# EAGLE design untitled (EAGLE 7.2.0)
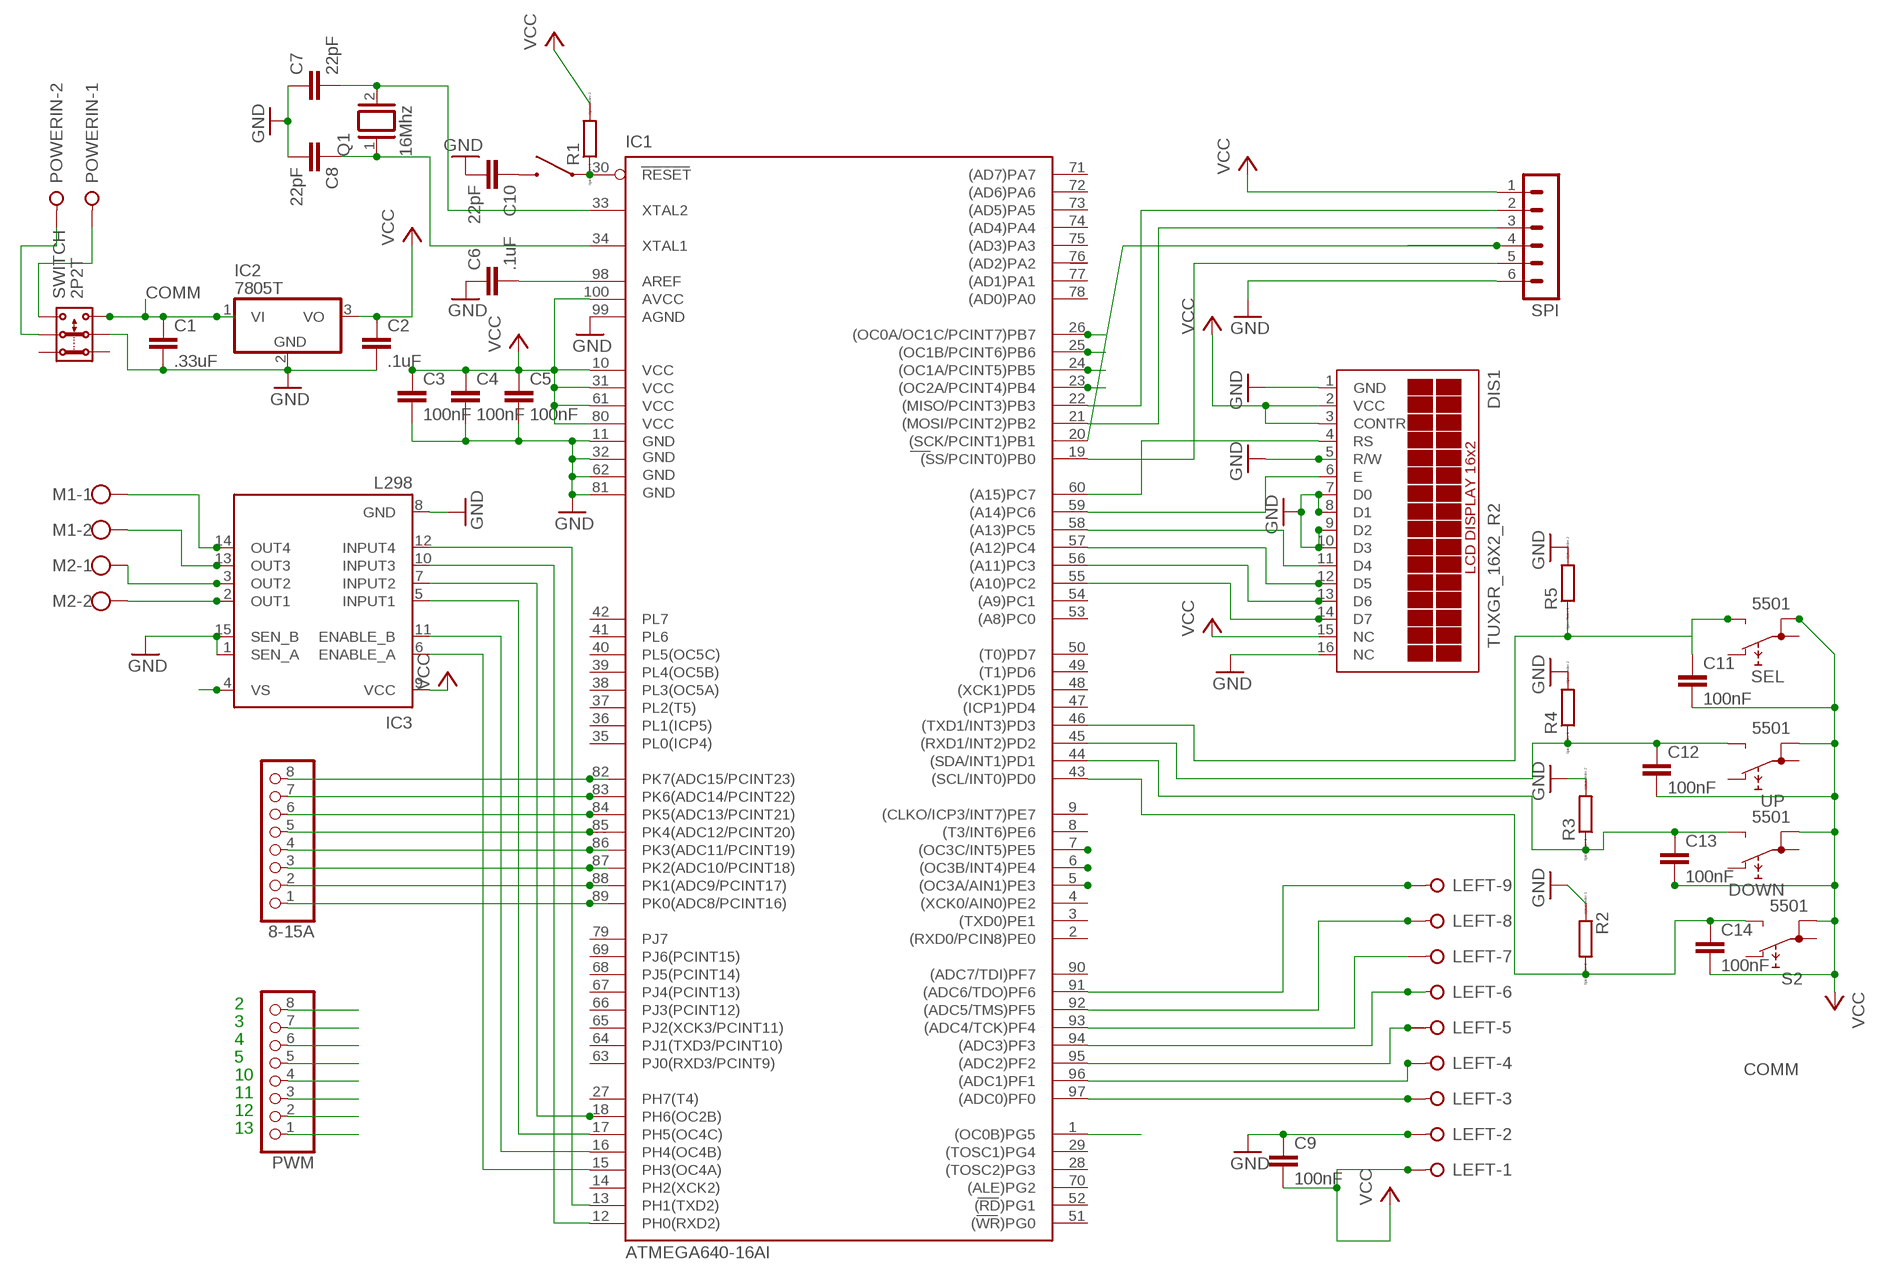
[diagram p0: schematic, sheet 1]

## Parts
8-15A  PINHD-1X8  [1X08]
C1  .33uF  C-EUC0805  [C0805]
C2  .1uF  C-EUC0805  [C0805]
C3  100nF  C-EUC0805  [C0805]
C4  100nF  C-EUC0805  [C0805]
C5  100nF  C-EUC0805  [C0805]
C6  .1uF  C-EUC0805  [C0805]
C7  22pF  C-EUC0805  [C0805]
C8  22pF  C-EUC0805  [C0805]
C9  100nF  C-EUC0805  [C0805]
C10  22pF  C-EUC0805  [C0805]
C11  100nF  C-EUC0805  [C0805]
C12  100nF  C-EUC0805  [C0805]
C13  100nF  C-EUC0805  [C0805]
C14  100nF  C-EUC0805  [C0805]
DIS1  TUXGR_16X2_R2  [TUXGR_16X2_R2]
DOWN  5501  [5501]
IC1  ATMEGA640-16AI  [TQFP100]
IC2  7805T  [TO220H]
IC3  L298  [MULTIWATT-15]
LEFT  W237-09P  [W237-9P]
M1  W237-102  [W237-102]
M2  W237-102  [W237-102]
POWERIN  W237-02P  [W237-132]
PWM  PINHD-1X8  [1X08]
Q1  16Mhz  XTAL/S  [QS]
R1  R  [R0805]
R2  R  [R0805]
R3  R  [R0805]
R4  R  [R0805]
R5  R  [R0805]
S2  5501  [5501]
SEL  5501  [5501]
SPI  MA06-1  [MA06-1]
SWITCH  2P2T  [2P2T]
U$1  TACT-SWITCH-40-40  [40-40]
UP  5501  [5501]

## Nets
2: IC1.6((OC3B/INT4)PE4) PWM.8
3: IC1.7((OC3C/INT5)PE5) PWM.7
4: IC1.1((OC0B)PG5) PWM.6
5: IC1.5((OC3A/AIN1)PE3) PWM.5
10: IC1.23((OC2A/PCINT4)PB4) PWM.4
11: IC1.24((OC1A/PCINT5)PB5) PWM.3
12: IC1.25((OC1B/PCINT6)PB6) PWM.2
13: IC1.26((OC0A/OC1C/PCINT7)PB7) PWM.1
24: IC1.76((AD2)PA2)
COMM: C1.1 IC2.1(VI) IC3.4(VS) SWITCH.3.2
GND: C1.2 C2.2 C3.2 C4.2 C5.2 C6.1 C7.1 C8.2 C9.1 C10.2 DIS1.1(GND) DIS1.5(R/W) DIS1.7(D0) DIS1.8(D1) DIS1.9(D2) DIS1.10(D3) DIS1.16(NC) IC1.11(GND) IC1.32(GND1) IC1.62(GND2) IC1.81(GND3) IC1.99(AGND) IC2.2(GND) IC3.1(SEN_A) IC3.8(GND) IC3.15(SEN_B) LEFT.2 R2.1 R3.2 R4.2 R5.2 SPI.6 SWITCH.2.2
N$1: POWERIN.1 SWITCH.3.1
N$2: IC3.13(OUT3) M1.2
N$3: IC3.14(OUT4) M1.1
N$4: IC3.2(OUT1) M2.2
N$5: IC3.3(OUT2) M2.1
N$6: POWERIN.2 SWITCH.2.1
N$7: C6.2 IC1.98(AREF)
N$8: C7.2 IC1.33(XTAL2) Q1.2
N$9: C8.1 IC1.34(XTAL1) Q1.1
N$10: IC1.97((ADC0)PF0) LEFT.3
N$11: C10.1 U$1.1 U$1.2
N$12: IC1.96((ADC1)PF1) LEFT.4
N$13: IC1.95((ADC2)PF2) LEFT.5
N$14: IC1.94((ADC3)PF3) LEFT.6
N$15: IC1.93((ADC4/TCK)PF4) LEFT.7
N$16: IC1.92((ADC5/TMS)PF5) LEFT.8
N$17: IC1.91((ADC6/TDO)PF6) LEFT.9
N$18: DIS1.4(RS) IC1.60((A15)PC7)
N$19: DIS1.6(E) IC1.59((A14)PC6)
N$20: DIS1.11(D4) IC1.58((A13)PC5)
N$21: DIS1.12(D5) IC1.57((A12)PC4)
N$22: DIS1.13(D6) IC1.56((A11)PC3)
N$23: DIS1.14(D7) IC1.55((A10)PC2)
N$24: IC1.15(PH3(OC4A)) IC3.6(ENABLE_A)
N$25: IC1.16(PH4(OC4B)) IC3.11(ENABLE_B)
N$26: IC1.17(PH5(OC4C)) IC3.5(INPUT1)
N$27: IC1.18(PH6(OC2B)) IC3.7(INPUT2)
N$28: IC1.12(PH0(RXD2)) IC3.10(INPUT3)
N$29: IC1.13(PH1(TXD2)) IC3.12(INPUT4)
N$30: IC1.30(RESET) R1.1 U$1.3 U$1.4
N$31: IC1.22((MISO/PCINT3)PB3) SPI.2
N$32: IC1.21((MOSI/PCINT2)PB2) SPI.3
N$33: IC1.20((SCK/PCINT1)PB1) SPI.4
N$34: IC1.19((SS/PCINT0)PB0) SPI.5
N$35: C14.1 IC1.43((SCL/INT0)PD0) R2.2 S2.NO
N$36: C13.1 DOWN.NO IC1.44((SDA/INT1)PD1) R3.1
N$37: C12.1 IC1.45((RXD1/INT2)PD2) R4.1 UP.NO
N$38: C11.1 IC1.46((TXD1/INT3)PD3) R5.1 SEL.NO
N$39: 8-15A.8 IC1.82(PK7(ADC15/PCINT23))
N$40: 8-15A.7 IC1.83(PK6(ADC14/PCINT22))
N$41: 8-15A.6 IC1.84(PK5(ADC13/PCINT21))
N$42: 8-15A.5 IC1.85(PK4(ADC12/PCINT20))
N$43: 8-15A.4 IC1.86(PK3(ADC11/PCINT19))
N$44: 8-15A.3 IC1.87(PK2(ADC10/PCINT18))
N$45: 8-15A.2 IC1.88(PK1(ADC9/PCINT17))
N$46: 8-15A.1 IC1.89(PK0(ADC8/PCINT16))
VCC: C2.1 C3.1 C4.1 C5.1 C9.2 C11.2 C12.2 C13.2 C14.2 DIS1.2(VCC) DIS1.3(CONTR) DIS1.15(NC) DOWN.1B IC1.10(VCC) IC1.31(VCC1) IC1.61(VCC2) IC1.80(VCC3) IC1.100(AVCC) IC2.3(VO) IC3.9(VCC) LEFT.1 R1.2 S2.1B SEL.1B SPI.1 UP.1B
Unconnected: DOWN.1A DOWN.NC IC1.2((RXD0/PCIN8)PE0) IC1.3((TXD0)PE1) IC1.4((XCK0/AIN0)PE2) IC1.8((T3/INT6)PE6) IC1.9((CLKO/ICP3/INT7)PE7) IC1.14(PH2(XCK2)) IC1.27(PH7(T4)) IC1.28((TOSC2)PG3) IC1.29((TOSC1)PG4) IC1.35(PL0(ICP4)) IC1.36(PL1(ICP5)) IC1.37(PL2(T5)) IC1.38(PL3(OC5A)) IC1.39(PL4(OC5B)) IC1.40(PL5(OC5C)) IC1.41(PL6) IC1.42(PL7) IC1.47((ICP1)PD4) IC1.48((XCK1)PD5) IC1.49((T1)PD6) IC1.50((T0)PD7) IC1.51((WR)PG0) IC1.52((RD)PG1) IC1.53((A8)PC0) IC1.54((A9)PC1) IC1.63(PJ0(RXD3/PCINT9)) IC1.64(PJ1(TXD3/PCINT10)) IC1.65(PJ2(XCK3/PCINT11)) IC1.66(PJ3(PCINT12)) IC1.67(PJ4(PCINT13)) IC1.68(PJ5(PCINT14)) IC1.69(PJ6(PCINT15)) IC1.70((ALE)PG2) IC1.71((AD7)PA7) IC1.72((AD6)PA6) IC1.73((AD5)PA5) IC1.74((AD4)PA4) IC1.75((AD3)PA3) IC1.77((AD1)PA1) IC1.78((AD0)PA0) IC1.79(PJ7) IC1.90((ADC7/TDI)PF7) S2.1A S2.NC SEL.1A SEL.NC SWITCH.1.1 SWITCH.1.2 UP.1A UP.NC

## Notes on the sheet
- 2
- 3
- 4
- 5
- 10
- 11
- 12
- 13

## Library data of the parts
8-15A PWM = pinhead:PINHD-1X8: PIN HEADER
C1-C14 = rcl:C-EU: CAPACITOR, European symbol
DIS1 = display-lcd:TUXGR_16X2_R2: Tuxgraphics LCD display 16x2 characters reflective, without background light Source: tuxgr_12x2_r2.pdf; OC_FARNELL: unknown; OC_NEWARK: unknown
DOWN S2 SEL UP = switch:55?: PUSHBUTTON SERIES 5500 SWITCHES Source: www.e-switch.com .. 5500.pdf
IC1 = atmel-2005:ATMEGA*: MICROCONTROLLER 64/128/256 Kbytes FLASH 4 Kbytes EEPROM 8 Kbytes SRAM 86 General Purpose I/O pins 12-channels16-bit PWM 4 x Serial USARTs 16-channels 10-bit A/D
IC2 = linear:78*: Positive VOLTAGE REGULATOR Source: http://cache.national.com/ds/LM/LM78L05.pdf http://www.fairchildsemi.com/ds/LM/LM7805.pdf
IC3 = st-microelectronics:L298: DUAL FULL-BRIDGE DRIVER; MPN: L298N; OC_FARNELL: 1589425; OC_NEWARK: 32M1527
LEFT = con-wago-508:W237-09P: WAGO SREW CLAMP; OC_FARNELL: unknown; OC_NEWARK: unknown
M1 M2 = con-wago-500:W237-102: WAGO SCREW CLAMP; MPN: 237-102; OC_FARNELL: unknown; OC_NEWARK: 70K9898
POWERIN = con-wago-508:W237-02P: WAGO SREW CLAMP; OC_FARNELL: unknown; OC_NEWARK: unknown
Q1 = special:XTAL/S: CRYSTAL
R1-R5 = eagle-ltspice:R: RESISTOR, European symbol; SPICEMODEL: NONE; SPICEPREFIX: R
SPI = con-lstb:MA06-1: PIN HEADER; OC_FARNELL: unknown; OC_NEWARK: unknown
SWITCH = switch:2P2T: SLIDE SWITCH 2P2T Part No. SS-22F05-G(A)4 Source: CANAL ELECTRONIC CO., LTD .. switsch.pdf
U$1 = tactile-switch:TACT-SWITCH-40-40

## Board
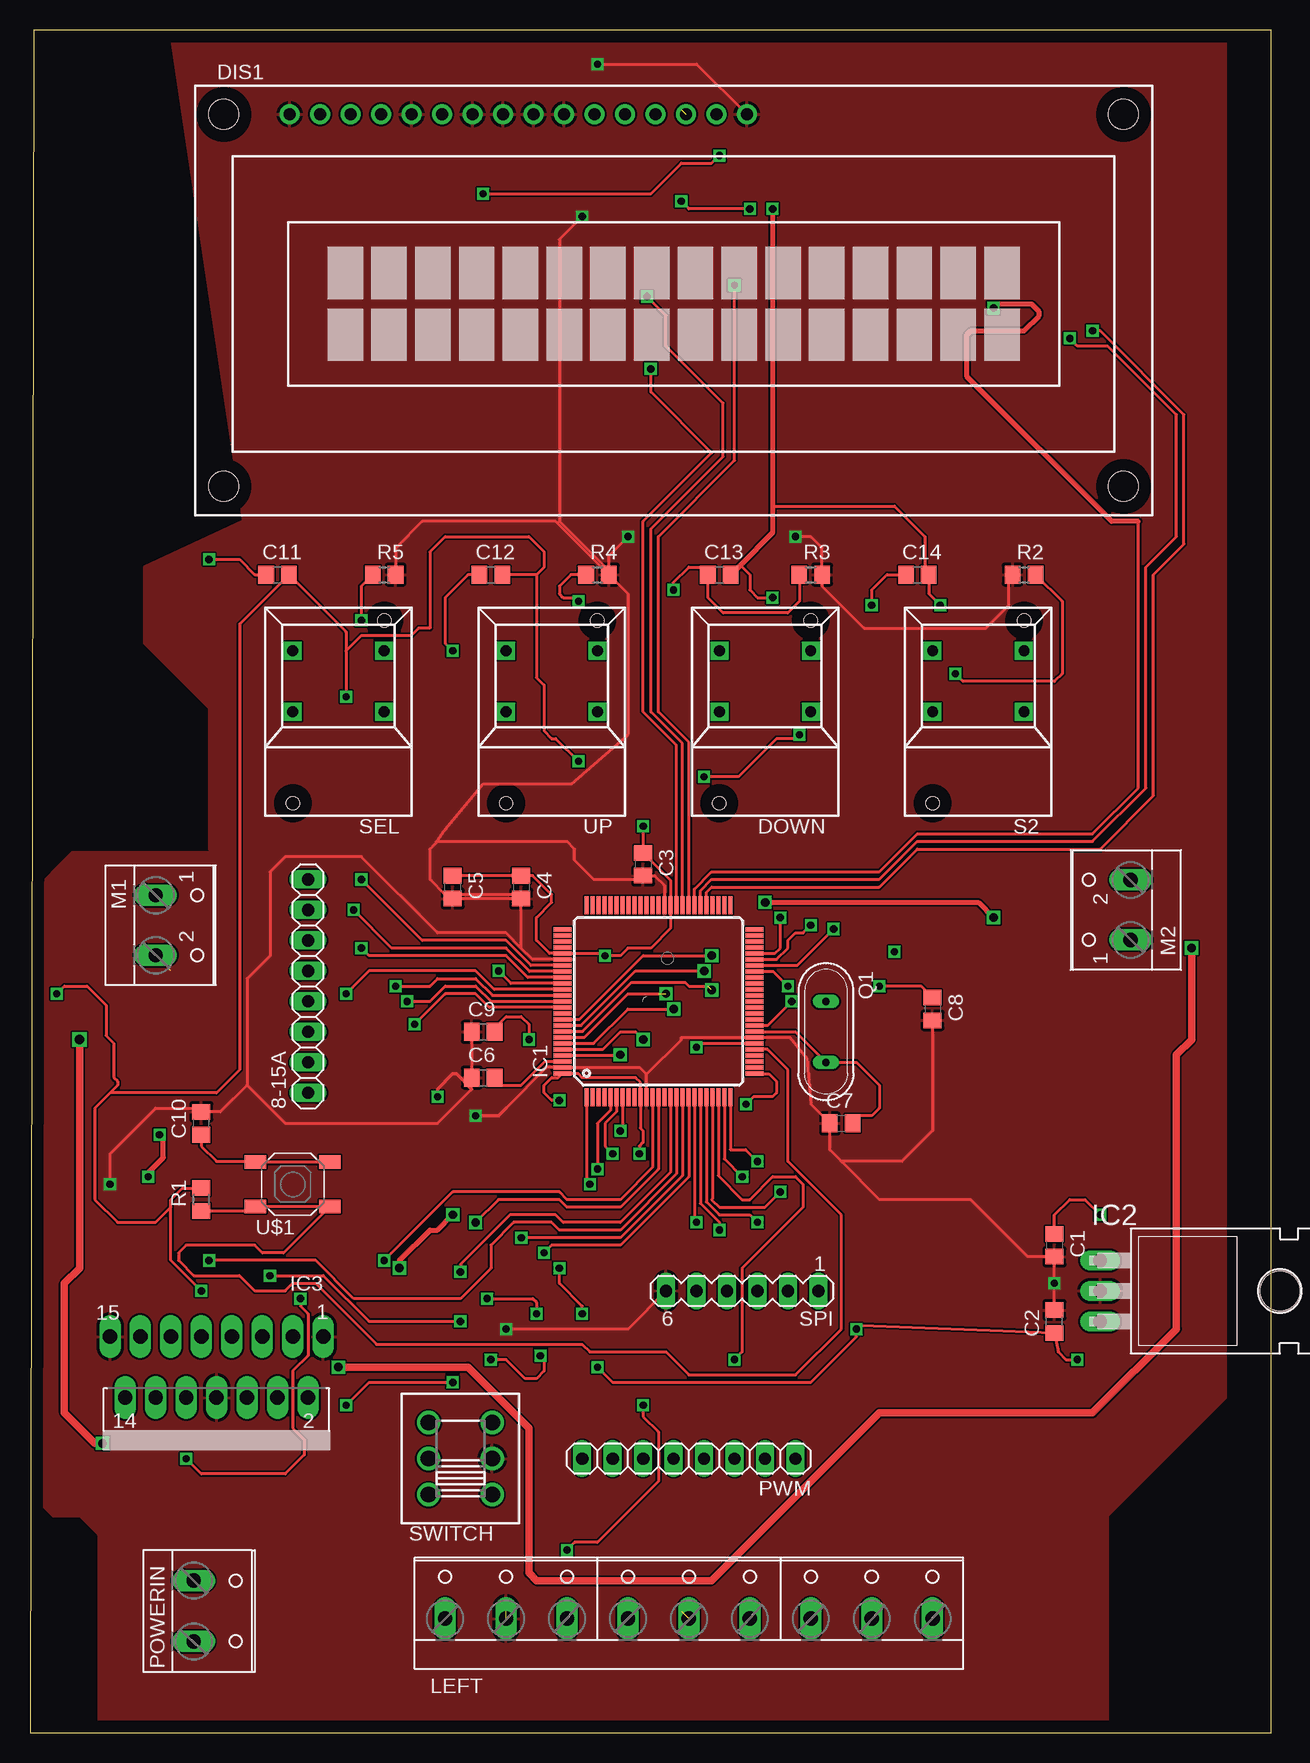
[diagram p1: board, top side]
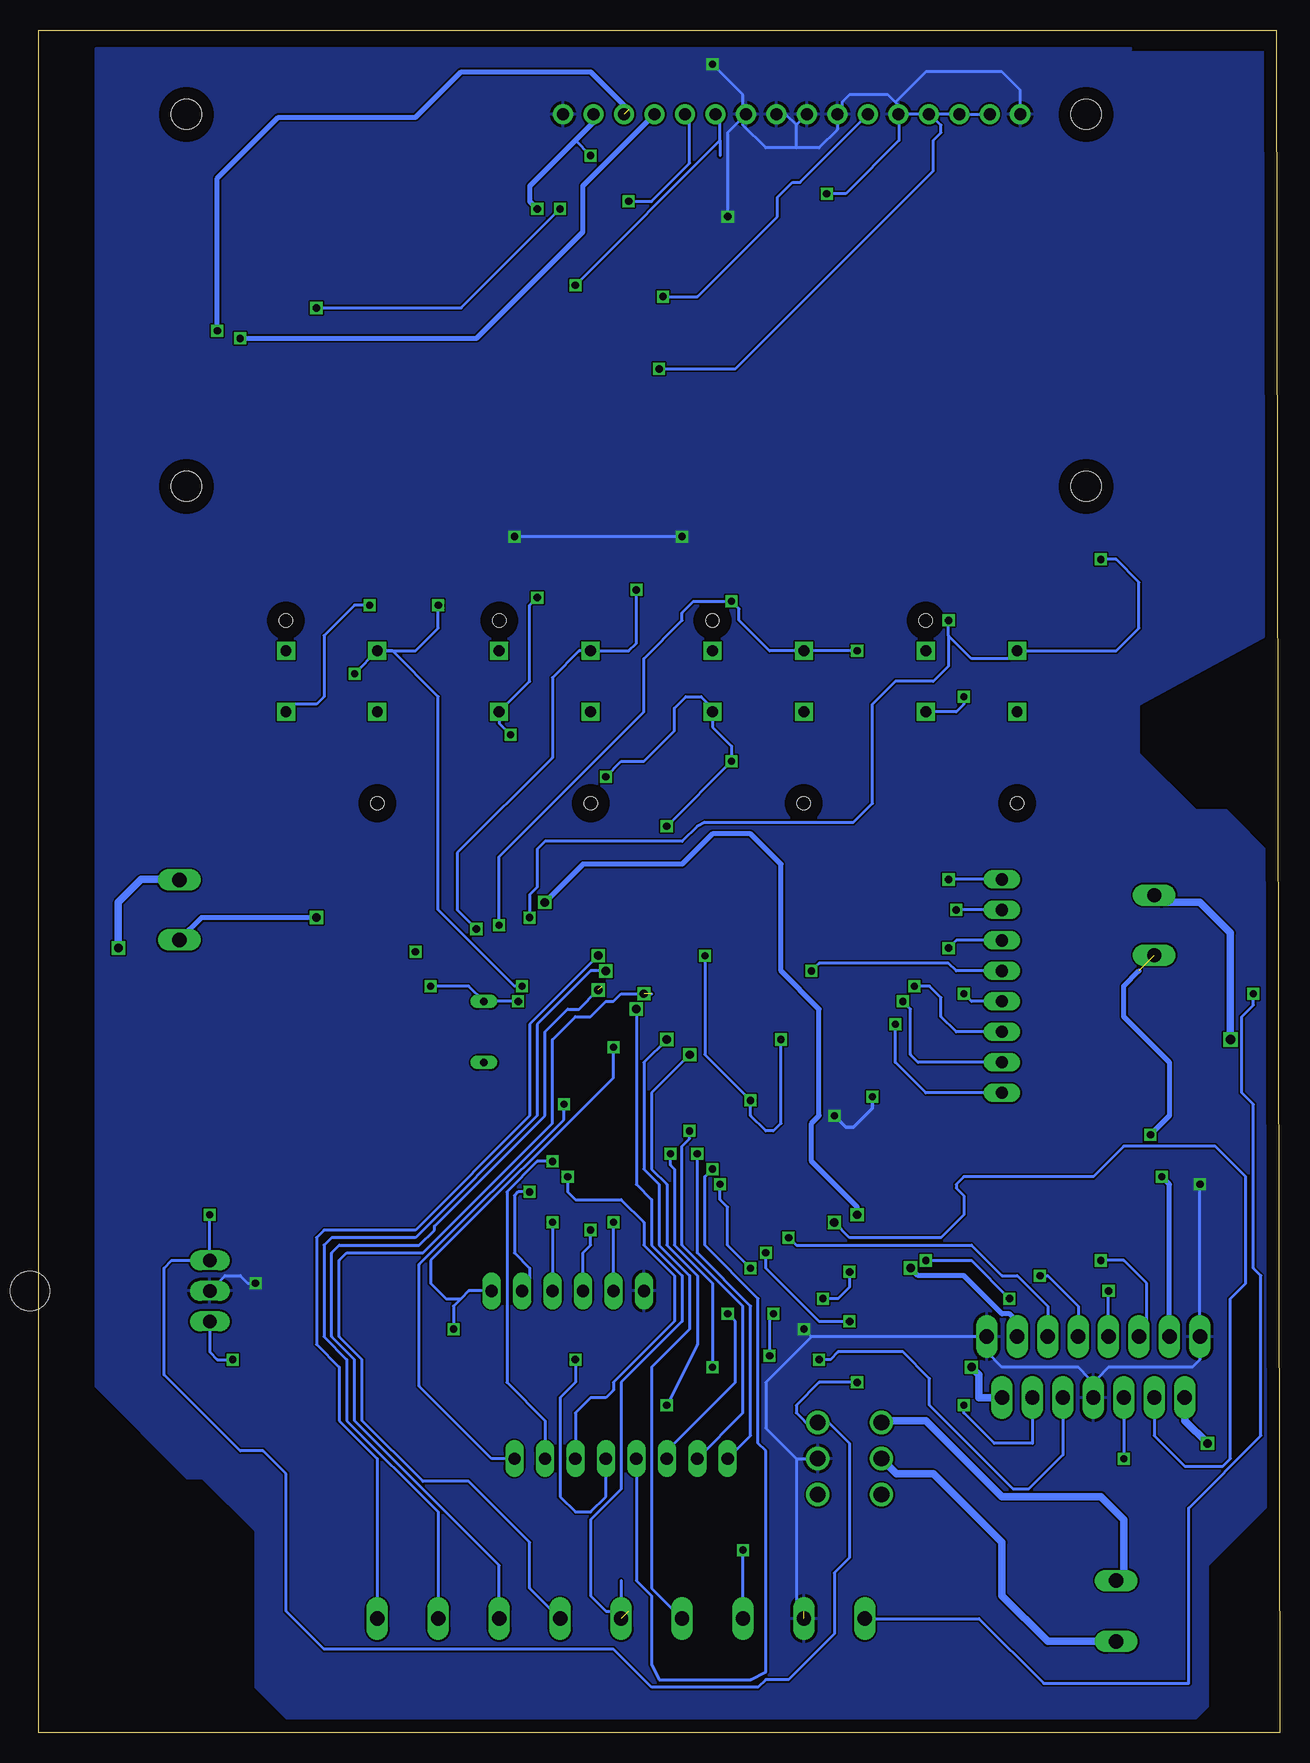
[diagram p2: board, bottom side, seen from below]

Size 103.48 x 141.91 mm. Coordinates in mm from the lower left corner, seen from the top.
Outline: 0,0 103.49,0 103.49,141.91 0.32,141.91 0,0
Copper layers (1*16): Top 0.035mm / dielectric 1.5mm / Bottom 0.035mm
Design rules "default *": minimum track width 10mil, minimum drill 24mil, track to track 6mil, track to pad 6mil, pad to pad 4mil, via to via 6mil, smd to smd 2mil, copper to edge 40mil, drill to drill 6mil, minimum pad ring 10mil, minimum via ring 8mil, stop-mask expansion 4mil, vias tented up to drill 0mil, thermal gap 10mil

### Footprints (pad centres in the part's own frame; a part is rotated, then mirrored left to right if it is on the bottom)
1X08 = drill 1.016 long: 1 -8.89,0; 2 -6.35,0; 3 -3.81,0; 4 -1.27,0; 5 1.27,0; 6 3.81,0; 7 6.35,0; 8 8.89,0
C0805 = smd 1.3 x 1.5: 1 -0.95,0; 2 0.95,0
TUXGR_16X2_R2 = drill 1 pad 1.676: 1 -32,15.5; 2 -29.46,15.5; 3 -26.92,15.5; 4 -24.38,15.5; 5 -21.84,15.5; 6 -19.3,15.5; 7 -16.76,15.5; 8 -14.22,15.5; 9 -11.68,15.5; 10 -9.14,15.5; 11 -6.6,15.5; 12 -4.06,15.5; 13 -1.52,15.5; 14 1.02,15.5; 15 3.56,15.5; 16 6.1,15.5 | hole 2.5: -37.5,-15.5; 37.5,-15.5; -37.5,15.5; 37.5,15.5
5501 = drill 0.9 pad 1.5 square: 1A 0,3.81; 1B 0,-3.81; NC 5.08,-3.81; NO 5.08,3.81 | hole 1.1: -7.62,3.81; 7.62,-3.81
TQFP100 = smd 1.5 x 0.35: 1 -8,6; 2 -8,5.5; 3 -8,5; 4 -8,4.5; 5 -8,4; 6 -8,3.5; 7 -8,3; 8 -8,2.5; 9 -8,2; 10 -8,1.5; 11 -8,1; 12 -8,0.5; 13 -8,0; 14 -8,-0.5; 15 -8,-1; 16 -8,-1.5; 17 -8,-2; 18 -8,-2.5; 19 -8,-3; 20 -8,-3.5; 21 -8,-4; 22 -8,-4.5; 23 -8,-5; 24 -8,-5.5; 25 -8,-6; 51 8,-6; 52 8,-5.5; 53 8,-5; 54 8,-4.5; 55 8,-4; 56 8,-3.5; 57 8,-3; 58 8,-2.5; 59 8,-2; 60 8,-1.5; 61 8,-1; 62 8,-0.5; 63 8,0; 64 8,0.5; 65 8,1; 66 8,1.5; 67 8,2; 68 8,2.5; 69 8,3; 70 8,3.5; 71 8,4; 72 8,4.5; 73 8,5; 74 8,5.5; 75 8,6 | smd 0.35 x 1.5: 26 -6,-8; 27 -5.5,-8; 28 -5,-8; 29 -4.5,-8; 30 -4,-8; 31 -3.5,-8; 32 -3,-8; 33 -2.5,-8; 34 -2,-8; 35 -1.5,-8; 36 -1,-8; 37 -0.5,-8; 38 0,-8; 39 0.5,-8; 40 1,-8; 41 1.5,-8; 42 2,-8; 43 2.5,-8; 44 3,-8; 45 3.5,-8; 46 4,-8; 47 4.5,-8; 48 5,-8; 49 5.5,-8; 50 6,-8; 76 6,8; 77 5.5,8; 78 5,8; 79 4.5,8; 80 4,8; 81 3.5,8; 82 3,8; 83 2.5,8; 84 2,8; 85 1.5,8; 86 1,8; 87 0.5,8; 88 0,8; 89 -0.5,8; 90 -1,8; 91 -1.5,8; 92 -2,8; 93 -2.5,8; 94 -3,8; 95 -3.5,8; 96 -4,8; 97 -4.5,8; 98 -5,8; 99 -5.5,8; 100 -6,8
TO220H = drill 1.118 long: 1 -2.54,-10.16; 2 0,-10.16; 3 2.54,-10.16 | hole 3.302: 0,4.826
MULTIWATT-15 = drill 1.2 long: 1 -8.89,-7.62; 2 -7.62,-2.54; 3 -6.35,-7.62; 4 -5.08,-2.54; 5 -3.81,-7.62; 6 -2.54,-2.54; 7 -1.27,-7.62; 8 0,-2.54; 9 1.27,-7.62; 10 2.54,-2.54; 11 3.81,-7.62; 12 5.08,-2.54; 13 6.35,-7.62; 14 7.62,-2.54; 15 8.89,-7.62
W237-9P = drill 1.194 long: 1 -20.32,-0.635; 2 -15.24,-0.635; 3 -10.16,-0.635; 4 -5.08,-0.635; 5 0,-0.635; 6 5.08,-0.635; 7 10.16,-0.635; 8 15.24,-0.635; 9 20.32,-0.635
W237-102 = drill 1.194 long: 1 -2.5,-1.27; 2 2.5,-1.27
W237-132 = drill 1.194 long: 1 -2.54,-0.635; 2 2.54,-0.635
QS = drill 0.61 long: 1 -2.54,0; 2 2.54,0
R0805 = smd 1.3 x 1.5: 1 -0.95,0; 2 0.95,0
MA06-1 = drill 1.016 long: 1 -6.35,0; 2 -3.81,0; 3 -1.27,0; 4 1.27,0; 5 3.81,0; 6 6.35,0
2P2T = drill 1.3 pad 1.93: 1.1 -3,2.65; 1.2 -3,-2.65; 2.1 0,2.65; 2.2 0,-2.65; 3.1 3,2.65; 3.2 3,-2.65
40-40 = smd 1.8 x 1.1: 1 -3.1,1.85; 2 3.1,1.85; 3 -3.1,-1.85; 4 3.1,-1.85

### Placement (x,y rotation side)
8-15A  23.18,62.23 90 top
C1  85.41,40.64 270 top
C2  85.41,34.29 90 top
C3  51.12,72.39 270 top
C4  40.96,70.48 270 top
C5  35.24,70.48 270 top
C6  37.78,54.61 0 top
C7  67.63,50.8 0 top
C8  75.25,60.32 270 top
C9  37.78,58.42 0 top
C10  14.29,50.8 90 top
C11  20.64,96.52 0 top
C12  38.42,96.52 0 top
C13  57.47,96.52 0 top
C14  73.98,96.52 0 top
DIS1  53.66,119.38 0 top
DOWN  61.28,85.09 90 top
IC1  52.39,60.96 90 top
IC2  99.38,36.83 270 top
IC3  15.56,25.4 180 top
LEFT  54.93,10.16 0 top
M1  11.75,67.31 270 top
M2  90.49,68.58 90 top
POWERIN  14.29,10.16 270 top
PWM  54.93,22.86 180 top
Q1  66.36,58.42 270 top
R1  14.29,44.45 90 top
R2  82.87,96.52 0 top
R3  65.09,96.52 0 top
R4  47.31,96.52 0 top
R5  29.53,96.52 0 top
S2  79.06,85.09 90 top
SEL  25.72,85.09 90 top
SPI  59.37,36.83 180 top
SWITCH  35.88,22.86 90 top
U$1  21.91,45.72 0 top
UP  43.5,85.09 90 top

### Tracks (layer width: path | path; a pad name or v marks a point on that pad's centre or on a via)
2  (via drill 0.6)
  Top 0.254: IC1.6 48.89,51.74 47.94,50.8 47.94,48.89 v48.58,48.26
  Bottom 0.254: PWM.8 44.13,24.77 44.13,35.56 48.58,40.01 v48.58,48.26
3  (via drill 0.6)
  Top 0.254: IC1.7 49.39,50.34 v49.21,50.16
  Bottom 0.254: PWM.7 44.77,26.67 44.77,35.56 49.85,40.64 49.85,48.89 49.21,49.53 v49.21,50.16
4  (via drill 0.6)
  Top 0.254: IC1.1 46.39,46.01 v46.67,45.72 | v46.04,34.92 46.04,35.56 44.13,37.46 v44.13,38.73
  Bottom 0.254: v44.13,38.73 46.04,40.64 46.04,43.81 46.67,44.45 v46.67,45.72 | PWM.6 51.12,23.49 45.4,29.21 45.4,34.29 v46.04,34.92
5  (via drill 0.6)
  Top 0.254: IC1.5 48.39,51.88 47.31,50.8 v47.31,46.99
  Bottom 0.254: PWM.5 53.66,12.7 52.39,11.43 52.39,5.71 51.75,4.45 44.13,4.45 42.86,5.08 42.86,23.49 43.5,24.13 43.5,36.2 47.94,40.64 47.94,46.35 v47.31,46.99
10  (via drill 0.6)
  Top 0.254: IC1.23 57.39,46.44 59.37,44.45 60.01,44.45 61.91,46.35 63.82,46.35 64.45,45.72 64.45,43.81 59.37,38.73 59.37,31.75 v58.74,31.11
  Bottom 0.254: v58.74,31.11 58.74,29.21 60.01,27.94 60.01,19.68 58.74,18.41 57.47,18.41 56.2,19.68 PWM.4
11  (via drill 0.6)
  Top 0.254: IC1.24 57.89,47.84 v59.37,46.35
  Bottom 0.254: v59.37,46.35 59.37,45.09 58.74,44.45 54.93,44.45 53.02,42.55 53.02,40.64 50.48,38.1 50.48,34.29 55.56,29.21 55.56,28.57 56.2,27.94 57.47,27.94 58.74,26.67 PWM.3
12  (via drill 0.6)
  Top 0.254: IC1.25 58.39,48.61 59.66,48.61 v60.64,47.62
  Bottom 0.254: v60.64,47.62 61.91,47.62 64.45,45.09 64.45,29.21 61.28,26.04 PWM.2
13  (via drill 0.6)
  Top 0.254: IC1.26 60.42,54.93 61.6,54.93 62.23,54.29 62.23,53.34 61.91,53.02 60.32,53.02 v59.69,52.39
  Bottom 0.254: PWM.1 65.72,22.86 71.75,28.89 71.75,39.05 59.69,51.12 v59.69,52.39
COMM  (via drill 0.6)
  Top 0.254: v26.35,27.3 28.26,29.21 v35.24,29.21 | C1.1 85.41,43.18 86.68,44.45 87.95,44.45 v89.22,43.18
  Bottom 0.254: IC3.4 20.64,24.13 23.81,24.13 26.35,26.67 v26.35,27.3 | v35.24,29.21 38.42,29.21 40.32,27.3 40.32,26.67 39.05,25.4 38.59,25.86 | v89.22,43.18 IC2.1 92.39,39.37 93.03,38.73 93.03,29.84 86.68,23.49 84.77,23.49 82.87,21.59 82.87,10.16 79.69,6.99 55.56,6.99 52.39,3.81 43.5,3.81 42.86,4.45 40.96,4.45 37.15,8.25 37.15,13.34 35.88,14.61 35.88,24.13 37.78,26.04 38.42,26.04 38.59,25.86 | SWITCH.3.2 38.59,25.86
GND  (via drill 0.6)  (2 unrouted)
  Top 0.254: v6.67,45.72 6.67,48.26 10.48,52.07 13.97,52.07 C10.2 15.87,51.75 18.1,53.98 | IC1.11 51.39,54.88 | 51.39,54.88 54.29,57.78 54.29,57.96 IC1.32 63.36,57.96 64.77,56.23 65.09,52.39 C7.1 66.67,48.58 67.63,47.62 | C4.2 C5.2 | C9.1 C6.1 36.83,53.66 33.97,50.8 21.27,50.8 18.1,53.98 | 51.39,54.88 50.81,55.46 IC1.99 43.08,55.46 39.69,52.07 | 40.96,65.41 C4.2 | 40.96,65.41 39.69,66.68 33.97,66.68 27.62,73.03 21.27,73.03 20,71.76 20,64.77 18.1,62.87 18.1,53.98 | IC1.62 52.89,70.62 52.07,71.44 C3.2 50.8,71.12 46.99,71.12 45.4,72.71 45.4,73.66 44.77,74.3 33.97,74.3 33.81,74.14 | IC1.81 41.9,64.46 40.96,65.41 | C4.2 40.96,69.85 34.61,69.85 33.34,71.12 33.34,73.66 33.81,74.14 | v47.31,139.06 55.57,139.06 DIS1.16 | v46.04,126.37 44.13,124.46 44.13,100.97 48.26,96.84 | 48.26,96.84 R4.2 | R4.2 43.81,100.97 32.7,100.97 30.48,98.74 R5.2 | 48.26,96.84 48.26,98.11 v49.85,99.7 | v63.82,99.7 65.09,99.7 66.04,98.75 R3.2 66.04,95.57 69.53,92.08 79.69,92.08 81.6,93.98 81.6,96.2 R2.1 | R4.2 49.85,94.93 49.85,83.19 45.09,79.06 37.78,79.06 34.61,75.25 33.81,74.14 | C2.2 v85.41,37.46 C1.2 83.18,39.69 78.42,44.45 70.8,44.45 67.63,47.62 | SPI.6 49.85,33.66 v39.69,33.66 | C8.2 75.25,50.16 72.71,47.62 67.63,47.62
  Top 0.305: 39.69,52.07 39.05,51.44 v37.15,51.44 | 36.83,53.66 35.57,54.93 35.24,54.93 33.97,53.66 33.97,53.02
  Bottom 0.254: v6.67,45.72 IC3.15 6.67,31.11 7.3,30.48 14.29,30.48 15.24,29.53 15.88,29.53 | 39.05,33.02 IC3.1 24.45,31.75 23.18,30.48 16.83,30.48 15.88,29.53 | 39.05,33.02 42.86,29.21 42.86,25.4 40.32,22.86 | 40.32,22.86 SWITCH.2.2 | IC3.8 15.56,29.21 15.88,29.53 | DIS1.5 31.82,135.64 32.07,135.89 | 32.07,135.89 32.7,136.53 35.88,136.53 36.51,135.89 36.51,135.26 DIS1.7 36.9,133.6 38.42,132.08 40.32,132.08 | 40.32,132.08 40.32,134 | 40.32,134 DIS1.8 | DIS1.9 41.21,134.88 40.32,134 | 40.32,132.08 42.86,132.08 44.77,133.98 44.77,134.63 | 44.77,134.63 DIS1.10 | DIS1.1 21.66,136.91 23.18,138.43 29.53,138.43 32.07,135.89 | 44.77,134.63 44.77,136.53 v47.31,139.06 | 44.77,134.63 46.04,133.36 v46.04,126.37 | v49.85,99.7 v63.82,99.7 | IC2.2 87.95,38.1 86.68,38.1 86.04,37.46 v85.41,37.46 | 40.32,22.86 40.32,10.8 39.69,10.16 | 39.05,33.02 v39.69,33.66
  Bottom 0.305: v37.15,51.44 36.2,50.48 35.56,50.48 33.97,52.07 33.97,53.02
  pour Top: 11.75,141.6 17.78,100.97 9.53,97.16 9.53,90.81 14.92,85.41 14.92,73.66 15.24,73.34 3.49,73.34 0,69.85 0,20 1.91,18.1 4.13,18.1 5.71,16.51 5.71,0.32 89.53,0.32 89.85,0.64 89.85,18.1 99.69,27.94 99.69,142.24
  pour Bottom: 12.38,140.33 98.74,140.33 98.74,28.89 91.12,21.27 89.85,21.27 85.41,16.83 85.41,3.81 82.87,1.27 6.99,1.27 6.03,2.22 6.03,13.97 0.64,19.37 0.64,73.03 4.45,76.84 6.99,76.84 11.75,81.6 11.75,85.73 0.64,91.76 0.64,140.02 12.7,140.02
N$1
  Bottom 0.61: POWERIN.1 13.02,13.34 13.02,17.78 14.92,19.68 23.18,19.68 29.53,26.04 33.05,26.04 SWITCH.3.1
N$2  (via drill 0.6)  (1 unrouted)
  Top 0.406: v9.84,46.35 9.84,46.67 11.11,47.94 11.11,49.53 v10.8,49.85
  Bottom 0.406: 11.75,63.5 13.02,62.23 13.02,59.69 9.21,55.88 9.21,51.44 v10.8,49.85 | IC3.13 9.21,45.72 v9.84,46.35
N$3  (via drill 0.7, 0.8)
  Top 0.61: v6.03,24.13 5.4,24.13 2.86,26.67 2.86,37.46 4.13,38.73 v4.13,57.78
  Bottom 0.61: IC3.14 7.94,26.04 v6.03,24.13 | v4.13,57.78 4.13,66.68 6.67,69.22 9.88,69.22 M1.1
N$4  (via drill 0.7)
  Top 0.61: v25.72,30.48 36.51,30.48 41.59,25.4 41.59,13.34 42.23,12.7 56.83,12.7 70.8,26.67 88.58,26.67 95.57,33.66 95.57,56.52 96.84,57.78 v96.84,65.41
  Bottom 0.61: IC3.2 25.08,27.94 25.08,29.84 v25.72,30.48 | v96.84,65.41 96.84,69.22 94.93,71.12 91.8,71.12 M2.2
N$5  (via drill 0.7)
  Top 0.406: v30.8,38.73 30.8,39.37 33.34,41.91 33.97,41.91 v35.24,43.18 | v61.28,69.22 79.06,69.22 v80.33,67.95
  Bottom 0.406: IC3.3 21.91,34.29 22.54,34.92 23.18,34.92 26.35,38.1 30.16,38.1 v30.8,38.73 | v35.24,43.18 35.24,43.81 39.05,47.62 39.05,50.8 38.42,51.44 38.42,60.32 41.59,63.5 41.59,72.39 44.13,74.93 47.31,74.93 49.85,72.39 58.1,72.39 v61.28,69.22 | v80.33,67.95 89.89,67.95 M2.1
N$6
  Bottom 0.61: POWERIN.2 19.37,7.62 23.18,11.43 23.18,15.88 28.89,21.59 31.96,21.59 SWITCH.2.1
N$7
  Top 0.254: C6.2 39.37,53.98 40.96,53.98 42.94,55.96 IC1.98
N$8
  Top 0.254: C7.2 68.58,51.12 68.9,51.44 70.17,51.44 70.8,52.07 70.8,53.98 68.9,55.88 Q1.2 63.82,58.42 60.43,58.42 IC1.33
N$9  (via drill 0.6)
  Top 0.254: C8.1 74.29,62.23 v70.8,62.23 | IC1.34 61.5,58.96 v63.5,60.96
  Bottom 0.254: v70.8,62.23 67.63,62.23 Q1.1 v63.5,60.96
N$10  (via drill 0.6, 0.7)
  Top 0.254: IC1.97 49.16,56.46 v49.21,56.52 | v51.12,27.3 51.12,26.35 52.39,25.08 52.39,20.95 47.31,15.88 45.4,15.88 v44.77,15.24
  Bottom 0.254: v49.21,56.52 52.39,53.34 52.39,46.99 51.12,45.72 51.12,40.64 48.58,38.1 48.58,32.38 v51.12,27.3 | LEFT.3 v44.77,15.24
N$11
  Top 0.254: C10.1 14.29,48.89 15.56,47.62 18.75,47.62 U$1.1 U$1.2
N$12  (via drill 0.7)
  Top 0.254: IC1.96 47.75,56.96 49.21,58.42 50.48,58.42 v51.12,57.78
  Bottom 0.254: LEFT.4 52.39,12.07 52.39,30.48 49.21,33.66 49.21,38.1 51.75,40.64 51.75,45.72 53.02,46.99 53.02,55.88 v51.12,57.78
N$13  (via drill 0.7)  (1 unrouted)
  Top 0.254: IC1.95 46.98,57.46 49.85,60.32 v53.66,60.32
  Bottom 0.254: 54.93,12.7 LEFT.5 | v53.66,60.32 53.66,45.72 52.39,44.45 52.39,40.64 49.85,38.1 49.85,34.29 54.93,29.21 54.93,20.32 57.47,17.78 57.47,11.43 56.2,10.16 54.29,10.16
N$14  (via drill 0.7)  (1 unrouted)
  Top 0.254: IC1.94 46.21,57.96 49.85,61.59 v53.02,61.59
  Bottom 0.254: LEFT.6 62.55,12.07 62.55,15.88 67.63,20.95 71.44,20.95 76.52,26.04 76.52,31.11 78.42,33.02 78.42,39.37 77.79,40.01 71.44,40.01 60.64,50.8 60.64,57.78 58.74,59.69 57.47,59.69 56.2,60.96 55.56,60.96 54.93,61.59 52.39,61.59
N$15  (1 unrouted)
  Top 0.254: IC1.93 46.08,58.46 50.17,62.55 54.61,62.55 54.93,62.23 56.52,62.23
  Bottom 0.254: LEFT.7 65.09,13.97 77.15,26.04 77.15,31.11 79.06,33.02 79.06,40.01 78.42,40.64 71.75,40.64 70.49,41.91 70.49,42.23 61.28,51.44 61.28,58.42 59.37,60.32 58.42,60.32 56.83,61.91
N$16  (via drill 0.7)
  Top 0.254: IC1.92 45.94,58.96 50.48,63.5 v56.2,63.5
  Bottom 0.254: v56.2,63.5 57.47,63.5 61.91,59.05 61.91,51.44 72.07,41.27 79.06,41.27 79.69,40.64 79.69,33.02 77.79,31.11 77.79,26.04 70.17,18.41 LEFT.8
N$17  (via drill 0.7)
  Top 0.254: IC1.91 45.81,59.46 51.12,64.77 v56.83,64.77
  Bottom 0.254: v56.83,64.77 62.55,59.05 62.55,51.44 72.07,41.91 79.69,41.91 80.33,41.27 80.33,32.38 78.42,30.48 78.42,26.04 75.25,22.86 LEFT.9
N$18  (via drill 0.6)
  Top 0.254: IC1.60 53.89,82.32 51.12,85.09 51.12,100.97 56.83,106.68 51.75,111.76 v51.75,113.67
  Bottom 0.254: v51.75,113.67 45.4,113.67 28.89,130.18 28.89,132.72 28.26,133.35 28.26,133.98 29.15,134.88 DIS1.4 29.21,134.81
N$19  (via drill 0.6)
  Top 0.254: IC1.59 54.39,82.46 51.75,85.09 51.75,100.33 57.78,106.36 57.78,110.81 53.02,115.57 53.02,118.11 v51.43,119.7
  Bottom 0.254: v51.43,119.7 48.58,119.7 41.91,126.37 41.91,127.95 40.64,129.22 40.02,129.22 DIS1.6
N$20  (via drill 0.6)
  Top 0.254: IC1.58 54.93,69 54.93,82.55 52.39,85.09 52.39,99.7 58.74,106.05 v58.74,120.65
  Bottom 0.254: 46.67,132.72 46.67,134.5 DIS1.11 | v58.74,120.65 46.67,132.72 | 46.67,132.72 46.67,131.44
N$21  (via drill 0.6)
  Top 0.254: IC1.57 55.39,70.31 56.83,71.76 70.8,71.76 73.98,74.93 88.58,74.93 92.39,78.74 92.39,100.97 | v60.01,127 54.93,127 v54.29,127.64
  Top 0.406: 92.39,100.97 90.17,100.97 78.11,113.03 78.11,116.52 78.42,116.84 82.87,116.84 84.14,118.11 84.14,118.43 83.5,119.06 80.64,119.06 v80.33,118.75
  Bottom 0.254: v80.33,118.75 68.26,118.75 v60.01,127 | v54.29,127.64 52.39,127.64 49.21,130.81 49.21,134.62 49.85,135.25 49.85,135.13 DIS1.12
N$22  (via drill 0.6)
  Top 0.254: IC1.56 55.89,70.18 56.83,71.12 70.8,71.12 73.98,74.3 88.58,74.3 93.03,78.74 93.03,97.16 95.57,99.7 95.57,109.86 89.85,115.57 87.31,115.57 v86.68,116.21
  Bottom 0.406: v86.68,116.21 66.99,116.21 58.1,125.1 58.1,128.91 DIS1.13
N$23  (via drill 0.6)  (1 unrouted)
  Top 0.254: IC1.55 56.39,70.04 56.83,70.48 70.8,70.48 73.98,73.66 89.22,73.66 93.66,78.11 93.66,96.52 96.2,99.06 96.2,109.86 89.22,116.84 v88.58,116.84
  Bottom 0.406: v88.58,116.84 88.58,129.54 83.5,134.62 72.07,134.62 68.26,138.43 57.47,138.43 54.29,135.25
N$24  (via drill 0.6)  (1 unrouted)
  Top 0.254: IC1.15 53.39,46.72 49.21,42.55 44.45,42.55 43.82,43.18 40,43.18 35.88,39.05 v35.88,38.42 | v38.1,36.2 41.91,36.2 42.23,35.88 v42.23,34.92 | v42.54,31.43 42.86,31.11 42.86,30.16 42.23,29.53 41.28,29.53 39.69,31.11 38.42,31.11
  Bottom 0.254: IC3.6 18.1,23.18 20.96,20.32 22.23,20.32 29.21,27.3 29.21,29.53 31.43,31.75 36.83,31.75 37.46,31.11 38.42,31.11 | v35.88,38.42 35.88,37.15 36.83,36.2 v38.1,36.2 | v42.23,34.92 42.54,34.61 v42.54,31.43
N$25  (via drill 0.6)
  Top 0.254: IC1.16 53.89,46.59 49.21,41.91 44.13,41.91 43.5,42.55 40.32,42.55 38.42,40.64 38.42,38.73 35.88,36.2 26.99,36.2 23.81,39.37 v14.92,39.37
  Bottom 0.254: v14.92,39.37 13.02,39.37 11.11,37.46 11.11,33.66 IC3.11
N$26  (via drill 0.6)
  Top 0.254: IC1.17 54.39,46.45 49.21,41.27 v40.96,41.27
  Bottom 0.254: v40.96,41.27 40.32,40.64 25.72,40.64 23.18,38.1 21.91,38.1 19.37,35.56 IC3.5
N$27  (via drill 0.6)
  Top 0.254: IC1.18 54.93,52.92 54.93,46.35 49.21,40.64 43.5,40.64 v42.86,40.01 | v20,38.1 24.45,38.1 28.26,34.29 v35.88,34.29
  Bottom 0.254: v35.88,34.29 38.42,34.29 42.86,38.73 v42.86,40.01 | v20,38.1 19.37,38.1 16.83,35.56 IC3.7
N$28  (via drill 0.6)
  Top 0.254: IC1.12 51.89,47.12 49.21,44.45 44.77,44.45 44.13,45.09 35.24,45.09 v29.53,39.37 | v13.02,22.86 14.29,21.59 21.27,21.59 22.86,23.18 22.86,24.45 21.91,25.4 21.91,30.16 23.18,31.43 23.18,34.92 22.54,35.56 v22.54,36.2
  Bottom 0.254: v29.53,39.37 25.72,39.37 v22.54,36.2 | IC3.10 v13.02,22.86
N$29  (via drill 0.7)
  Top 0.254: IC1.13 52.39,46.99 49.21,43.81 44.77,43.81 44.13,44.45 39.05,44.45 v37.15,42.55
  Bottom 0.254: IC3.12 10.48,24.77 7.94,22.22 4.76,22.22 4.13,22.86 4.13,36.2 2.86,37.46 2.86,46.35 5.4,48.89 13.02,48.89 15.56,46.35 26.35,46.35 26.99,45.72 26.99,45.4 26.35,44.77 26.35,43.18 28.26,41.27 35.88,41.27 v37.15,42.55
N$30
  Top 0.254: R1.1 18.44,43.5 U$1.3 U$1.4 21.14,40.01 19.37,40.01 18.73,40.64 13.02,40.64 12.38,40.01 12.38,39.37 13.65,38.1 17.46,38.1 18.73,36.83 21.27,36.83 21.91,37.46 23.81,37.46 28.89,32.38 46.04,32.38 46.67,31.75 53.02,31.75 54.93,29.84 63.82,29.84 67.63,33.66 67.63,43.18 63.18,47.62 63.18,55.24 61.47,56.96 IC1.30
N$31  (via drill 0.6)
  Top 0.254: IC1.22 56.89,44.51 56.83,44.45 57.47,43.81 61.28,43.81 v62.55,45.09
  Bottom 0.254: SPI.2 62.55,37.46 62.55,38.73 63.82,40.01 63.82,44.77 63.5,45.09 v62.55,45.09
N$32  (via drill 0.6)
  Top 0.254: IC1.21 56.39,44.26 57.47,43.18 60.01,43.18 v60.64,42.55
  Bottom 0.254: v60.64,42.55 SPI.3
N$33  (via drill 0.6)
  Top 0.254: IC1.20 55.89,44.12 57.47,42.55 v57.47,41.91
  Bottom 0.254: SPI.4 58.1,40.01 57.47,40.64 v57.47,41.91
N$34  (via drill 0.6)
  Top 0.254: IC1.19 55.39,42.72 v55.56,42.55
  Bottom 0.254: SPI.5 v55.56,42.55
N$35  (via drill 0.6)
  Top 0.254: IC1.43 61.95,63.46 v63.18,62.23 | v70.17,93.98 70.17,95.25 71.44,96.52 C14.1 | R2.2 86.04,94.3 86.04,88.27 85.41,87.63 77.79,87.63 v77.15,88.27
  Bottom 0.254: v63.18,62.23 63.82,62.23 70.17,68.58 70.17,86.36 73.98,90.17 S2.NO | S2.NO 72.07,90.17 70.17,92.08 v70.17,93.98 | S2.NO v77.15,88.27
N$36  (via drill 0.6)
  Top 0.254: v53.66,95.25 53.66,95.89 54.93,97.16 56.2,97.16 56.2,96.84 C13.1 56.52,94.62 57.78,93.35 63.18,93.35 64.14,94.3 R3.1 | IC1.44 63.96,63.96 v66.99,66.99
  Bottom 0.254: v53.66,95.25 53.66,90.81 54.29,90.17 DOWN.NO 58.42,90.17 60.64,87.95 60.64,81.28 68.58,73.34 68.58,68.58 v66.99,66.99
N$37  (via drill 0.6)
  Top 0.254: C12.1 36.51,96.52 34.61,94.62 34.61,90.81 v35.24,90.17 | IC1.45 62.24,64.46 63.18,65.41 63.18,66.04 63.82,66.68 64.45,66.68 v65.09,67.31 | R4.1 45.09,96.52 44.13,95.57 44.13,94.93 44.45,94.62 45.4,94.62 v45.72,94.3
  Bottom 0.254: v35.24,90.17 UP.NO 42.54,90.17 45.09,92.71 45.09,93.66 v45.72,94.3 48.89,94.3 49.85,93.35 49.85,92.71 53.02,89.54 53.02,85.09 65.09,73.03 v65.09,67.31
N$38  (via drill 0.6)  (1 unrouted)
  Top 0.254: R5.1 27.62,95.57 v27.62,92.71 | v14.92,97.79 17.46,97.79 18.73,96.52 C11.1 | IC1.46 62.1,64.96 62.55,65.41 62.55,67.95
  Bottom 0.254: 27.62,91.44 25.72,89.54 22.54,89.54 SEL.NO 13.65,90.17 11.75,92.08 11.75,95.89 13.65,97.79 v14.92,97.79 | 27.62,91.44 v27.62,92.71 | 27.62,91.44 27.62,88.9 28.89,87.63 32.07,87.63 33.97,85.73 33.97,77.47 35.56,75.88 47.94,75.88 48.58,75.57 49.85,74.3 61.28,74.3 61.91,73.66 61.91,70.48 62.55,69.85 62.55,67.95
N$39  (via drill 0.6)
  Top 0.254: IC1.82 41.77,63.96 39.69,66.04 32.7,66.04 v27.62,71.12
  Bottom 0.254: 8-15A.8 v27.62,71.12
N$40  (via drill 0.6)
  Top 0.254: IC1.83 41.63,63.46 39.69,65.41 30.16,65.41 v26.99,68.58
  Bottom 0.254: 8-15A.7 v26.99,68.58
N$41  (via drill 0.6)
  Top 0.254: IC1.84 41.5,62.96 39.69,64.77 28.26,64.77 v27.62,65.41
  Bottom 0.254: 8-15A.6 26.99,66.04 v27.62,65.41
N$42  (via drill 0.6)
  Top 0.254: IC1.85 40.09,62.46 v39.05,63.5
  Bottom 0.254: 8-15A.5 26.99,63.5 27.62,64.14 38.42,64.14 v39.05,63.5
N$43  (via drill 0.6)
  Top 0.254: IC1.86 38.69,61.96 37.15,63.5 28.26,63.5 v26.35,61.59
  Bottom 0.254: 8-15A.4 25.72,60.96 v26.35,61.59
N$44  (via drill 0.6)
  Top 0.254: v30.48,62.23 33.34,62.23 33.97,62.87 37.15,62.87 38.55,61.46 IC1.87
  Bottom 0.254: 8-15A.3 26.99,58.42 28.26,59.69 28.26,61.28 29.21,62.23 v30.48,62.23
N$45  (via drill 0.6)
  Top 0.254: v31.43,60.96 33.34,60.96 34.61,62.23 37.15,62.23 38.42,60.96 IC1.88
  Bottom 0.254: 8-15A.2 30.16,55.88 30.8,56.52 30.8,60.32 v31.43,60.96
N$46  (1 unrouted)
  Top 0.254: IC1.89 38.28,60.46 37.15,61.59 34.61,61.59 32.07,59.05
  Bottom 0.254: 8-15A.1 29.53,53.34 32.07,55.88 32.07,59.05
N$55  (via drill 0.6)
  other vias: 32.07,59.05
N$57  (via drill 0.7 pad 0.81)
  other vias: 56.83,61.91
N$58  (via drill 0.6)
  other vias: 41.59,57.78
N$60  (via drill 0.6)
  other vias: 72.07,65.09
N$61  (via drill 0.6)
  other vias: 87.31,31.11
N$64  (via drill 0.6)
  other vias: 62.55,67.95
N$66  (via drill 0.6)
  other vias: 38.42,31.11
N$69  (via drill 0.6)
  other vias: 33.97,53.02
VCC  (via drill 0.6)  (2 unrouted)
  Top 0.254: v14.29,36.83 11.75,39.37 11.75,43.81 | 11.75,43.81 11.75,44.45 12.7,45.4 R1.2 | C5.1 C4.1 41.91,71.44 43.5,69.85 43.5,69.22 42.23,67.95 42.23,66.04 43.31,64.96 IC1.80 47.75,64.96 v47.94,64.77 49.21,64.77 49.85,65.41 51.75,65.41 53.39,67.04 IC1.61 53.39,71.07 C3.1 v51.12,75.57 | v44.13,52.7 43.5,52.7 42.86,53.34 42.86,53.98 43.5,54.61 44.04,54.61 IC1.100 45.69,54.96 46.04,54.61 50.48,54.61 50.89,54.2 IC1.10 50.89,50.39 51.12,50.16 51.12,49.21 50.8,48.89 v50.8,48.26 | 6.67,53.34 15.56,53.34 17.46,55.24 17.46,92.4 C11.2 26.35,91.76 26.35,90.17 | 6.67,53.34 5.4,52.07 5.4,44.45 7.3,42.55 10.48,42.55 11.75,43.81 | 26.35,90.17 v26.35,86.36 | 42.23,96.52 42.86,97.16 42.86,98.43 41.59,99.7 34.61,99.7 33.34,98.43 33.34,92.08 32.39,92.08 31.75,91.44 27.62,91.44 26.35,90.17 | 42.23,96.52 C12.2 | 61.91,100.02 61.91,102.23 72.07,102.23 74.61,99.7 74.61,96.84 C14.2 74.93,94.94 v75.88,93.98 | 59.21,97.32 60.01,96.52 60.01,95.25 60.64,94.62 v61.91,94.62 | v47.31,30.48 48.58,29.21 65.09,29.21 68.9,33.02 v68.9,33.66 69.22,33.98 C2.1 85.72,31.75 86.36,31.11 87.31,31.11 | v55.56,57.15 55.87,57.46 IC1.31 | v37.78,128.27 51.75,128.27 54.29,130.81 56.83,130.81 v57.47,131.44 | 39.05,59.05 39.05,58.42 C9.2 38.73,58.73 39.05,59.05 | 39.05,59.05 39.69,59.69 40.96,59.69 41.59,59.05 41.59,57.78 | v2.22,61.59 2.86,62.23 4.76,62.23 6.35,60.64 6.35,58.1 6.98,57.47 6.98,54.61 7.3,54.29 7.3,53.98 6.67,53.34 | 42.23,96.52 42.23,87.95 42.86,87.31 42.86,83.5 43.5,82.87 43.82,82.87 v45.72,80.96 | v64.14,83.19 63.82,82.87 62.23,82.87 59.06,79.69 v56.2,79.69
  Top 0.406: v61.91,127 61.91,100.02 59.21,97.32 C13.2
  Bottom 0.254: DIS1.2 DIS1.3 26.8,134.94 31.75,134.94 31.75,132.72 36.2,128.27 v37.78,128.27 | v57.47,131.44 58.74,132.72 | v26.35,86.36 26.35,85.73 26.99,85.09 SEL.1B | v61.91,94.62 62.55,93.98 62.55,87.63 DOWN.1B 65.09,84.14 v64.14,83.19 | v75.88,93.98 77.15,93.98 79.69,91.44 79.69,86.36 80.33,85.73 82.23,85.73 S2.1B | v51.12,75.57 v45.72,80.96 45.72,82.23 47.31,83.82 UP.1B 47.31,85.41 48.26,86.36 49.53,86.36 50.48,85.41 50.48,83.5 53.02,80.96 54.93,80.96 v56.2,79.69 | v47.31,30.48 47.31,37.46 50.48,40.64 50.48,46.99 50.8,47.31 v50.8,48.26 | SPI.1 67.63,36.83 68.26,36.2 | 68.26,36.2 68.9,35.56 v68.9,33.66 | IC2.3 89.22,31.75 88.58,31.11 87.31,31.11 | 68.26,36.2 69.53,36.2 70.8,37.46 70.8,39.37 55.56,54.61 v55.56,57.15 | v47.94,64.77 47.94,56.52 v44.13,52.7 44.13,51.44 42.86,50.16 42.23,50.16 41.59,50.8 41.59,57.78 | IC3.9 v14.29,36.83 | LEFT.1 25.08,9.53 19.68,4.13 7.62,4.13 7.62,18.73 1.59,24.77 1.59,38.1 2.22,38.73 2.22,52.39 3.17,53.34 3.17,59.69 2.22,60.64 v2.22,61.59
  Bottom 0.406: DIS1.15 57.22,134.23 58.74,132.72 62.55,128.91 62.55,127.64 v61.91,127